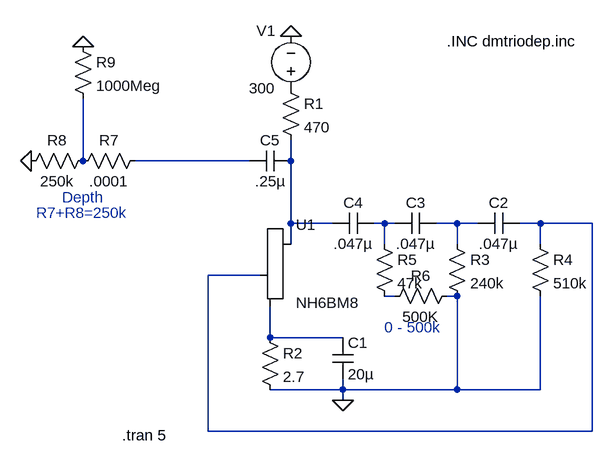
[diagram p0: schematic Gibson_tremolo.asc]
Gibson_tremolo.asc, the LTspice schematic file:
Version 4
SHEET 1 880 680
WIRE -240 160 -240 64
WIRE 16 160 -160 160
WIRE 80 160 80 128
WIRE 80 256 80 160
WIRE 144 256 80 256
WIRE 224 256 208 256
WIRE 240 256 224 256
WIRE 336 256 304 256
WIRE 368 256 336 256
WIRE 464 256 432 256
WIRE 544 256 464 256
WIRE 80 288 80 256
WIRE 224 288 224 256
WIRE 336 288 336 256
WIRE 464 288 464 256
WIRE 32 336 -48 336
WIRE 240 368 224 368
WIRE 336 368 320 368
WIRE 48 432 48 384
WIRE 160 432 48 432
WIRE 160 512 160 496
WIRE 160 512 48 512
WIRE 336 512 336 368
WIRE 336 512 160 512
WIRE 464 512 464 368
WIRE 464 512 336 512
WIRE 160 528 160 512
WIRE -48 576 -48 336
WIRE 544 576 544 256
WIRE 544 576 -48 576
FLAG 160 528 0
FLAG 80 -32 0
FLAG -320 160 0
FLAG -240 -16 0
SYMBOL voltage 80 64 R180
WINDOW 0 24 104 Left 0
WINDOW 3 24 16 Left 0
WINDOW 123 0 0 Left 0
WINDOW 39 0 0 Left 0
SYMATTR InstName V1
SYMATTR Value 300
SYMBOL res 64 32 R0
SYMATTR InstName R1
SYMATTR Value 470
SYMBOL Misc\\triode 80 336 R0
SYMATTR InstName U1
SYMATTR Value NH6BM8
SYMBOL res 32 416 R0
SYMATTR InstName R2
SYMATTR Value 2.7
SYMBOL cap 144 432 R0
SYMATTR InstName C1
SYMATTR Value 20µ
SYMBOL res 320 272 R0
SYMATTR InstName R3
SYMATTR Value 240k
SYMBOL res 448 272 R0
SYMATTR InstName R4
SYMATTR Value 510k
SYMBOL cap 432 240 R90
WINDOW 0 0 32 VBottom 0
WINDOW 3 32 32 VTop 0
SYMATTR InstName C2
SYMATTR Value .047µ
SYMBOL cap 304 240 R90
WINDOW 0 0 32 VBottom 0
WINDOW 3 32 32 VTop 0
SYMATTR InstName C3
SYMATTR Value .047µ
SYMBOL cap 208 240 R90
WINDOW 0 0 32 VBottom 0
WINDOW 3 32 32 VTop 0
SYMATTR InstName C4
SYMATTR Value .047µ
SYMBOL res 208 272 R0
SYMATTR InstName R5
SYMATTR Value 47k
SYMBOL res 336 352 R90
WINDOW 0 0 56 VBottom 0
WINDOW 3 32 56 VTop 0
SYMATTR InstName R6
SYMATTR Value 500K
SYMBOL cap 80 144 R90
WINDOW 0 0 32 VBottom 0
WINDOW 3 32 32 VTop 0
SYMATTR InstName C5
SYMATTR Value .25µ
SYMBOL res -144 144 R90
WINDOW 0 0 56 VBottom 0
WINDOW 3 32 56 VTop 0
SYMATTR InstName R7
SYMATTR Value .0001
SYMBOL res -224 144 R90
WINDOW 0 0 56 VBottom 0
WINDOW 3 32 56 VTop 0
SYMATTR InstName R8
SYMATTR Value 250k
SYMBOL res -256 -32 R0
SYMATTR InstName R9
SYMATTR Value 1000Meg
TEXT 224 416 Left 0 ;0 - 500k
TEXT -272 216 Left 0 ;Depth
TEXT -312 240 Left 0 ;R7+R8=250k
TEXT 320 -24 Left 0 !.INC dmtriodep.inc
TEXT -180 582 Left 0 !.tran 5

The netlist it stands for:
* Gibson_tremolo.asc
V1 P001 0 300
R1 P001 N003 470
XU1 N003 N006 N008 NH6BM8
R2 N008 0 2.7
C1 N008 0 20µ
R3 N005 0 240k
R4 N006 0 510k
C2 N006 N005 .047µ
C3 N005 N004 .047µ
C4 N004 N003 .047µ
R5 N004 N007 47k
R6 0 N007 500K
C5 N003 N002 .25µ
R7 N002 N001 .0001
R8 N001 0 250k
R9 0 N001 1000Meg
* 0 - 500k
* Depth
* R7+R8=250k
.INC dmtriodep.inc
.tran 5
.backanno
.end